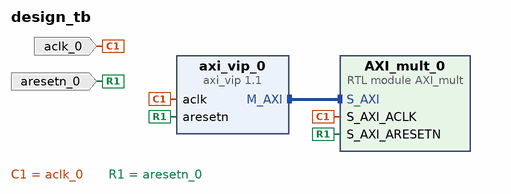
[diagram p0: block diagram of the top level]
# Vivado block design design_tb, xc7z020clg400-1, Vivado 2018.3
create_bd_design design_tb

create_bd_port -dir I -type clk aclk_0
create_bd_port -dir I -type rst aresetn_0

create_bd_cell -type ip -vlnv xilinx.com:ip:axi_vip:1.1 axi_vip_0
set_property -dict [list \
  CONFIG.ADDR_WIDTH 32 \
  CONFIG.DATA_WIDTH 32 \
  CONFIG.HAS_BRESP 1 \
  CONFIG.HAS_PROT 1 \
  CONFIG.HAS_RRESP 1 \
  CONFIG.HAS_WSTRB 1 \
  CONFIG.INTERFACE_MODE MASTER \
  CONFIG.PROTOCOL AXI4LITE \
  CONFIG.READ_WRITE_MODE READ_WRITE \
] [get_bd_cells axi_vip_0]
create_bd_cell -type module -reference AXI_mult AXI_mult_0

# ---- connections ----

connect_bd_intf_net [get_bd_intf_pins axi_vip_0/M_AXI] [get_bd_intf_pins AXI_mult_0/S_AXI]
connect_bd_net -net aclk_0_1 [get_bd_ports aclk_0] [get_bd_pins axi_vip_0/aclk] [get_bd_pins AXI_mult_0/S_AXI_ACLK]
connect_bd_net -net aresetn_0_1 [get_bd_ports aresetn_0] [get_bd_pins axi_vip_0/aresetn] [get_bd_pins AXI_mult_0/S_AXI_ARESETN]

# ---- address map ----
assign_bd_address -offset 0x44A00000 -range 64K -target_address_space [get_bd_addr_spaces axi_vip_0/Master_AXI] [get_bd_addr_segs AXI_mult_0/S_AXI/reg0]

validate_bd_design
save_bd_design
